# EAGLE design Testing_LAB_EMG_V1.2 (EAGLE 7.7.0)
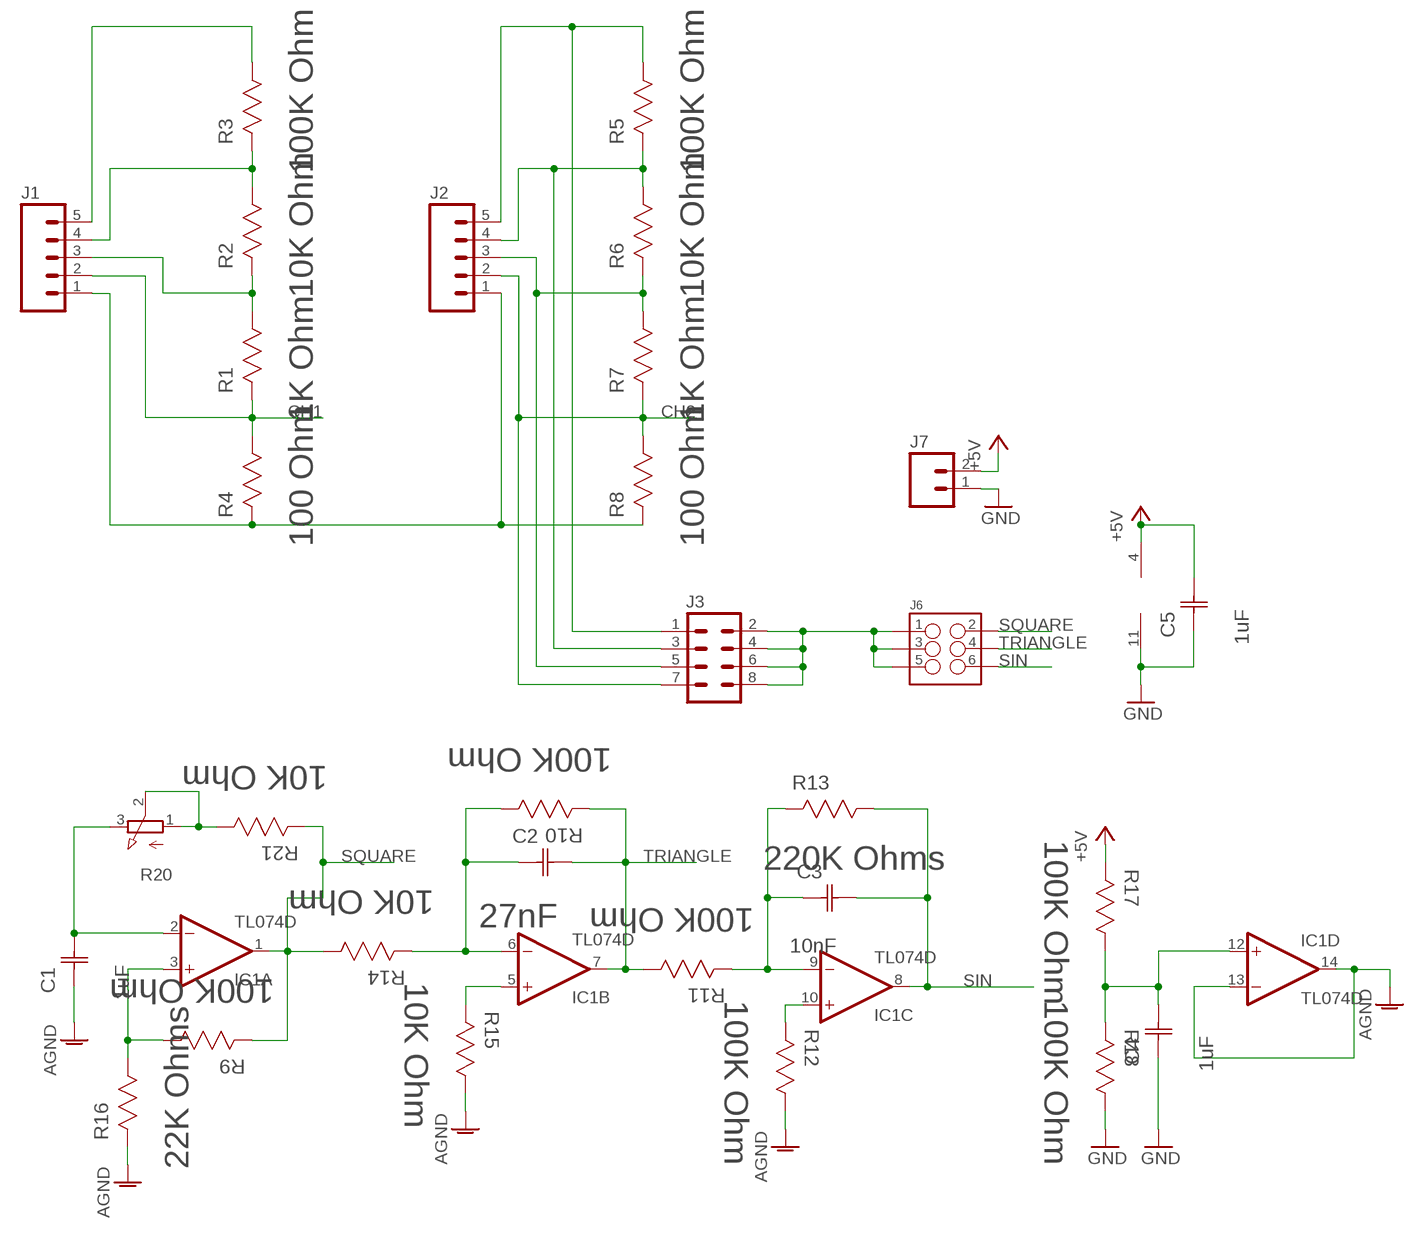
[diagram p0: schematic, sheet 1]

## Parts
C1  1uF  0603YC105KAT2A  [CAPC1608X94N]
C2  27nF  C0402C273K3RACTU  [CAPC1005X60N]
C3  10nF  06031C103KAT2A  [CAPC1608X90N]
C4  1uF  0603YC105KAT2A  [CAPC1608X94N]
C5  1uF  0603YC105KAT2A  [CAPC1608X94N]
IC1  TL074D  [SO14]
J1  M05PTH  [1X05]
J2  M05PTH  [1X05]
J3  M04X2  [2X4]
J6  M03X2NO_SILK  [2X3-NS]
J7  M02PTH  [1X02]
R1  1K Ohm  9C06031A1001FKHFT  [RESC1608X60N]
R2  10K Ohm  9C06031A1002JLHFT  [RESC1608X60N]
R3  100K Ohm  9C06031A1003FKHFT  [RESC1608X60N]
R4  100 Ohm  9C06031A1000JLHFT  [RESC1608X60N]
R5  100K Ohm  9C06031A1003FKHFT  [RESC1608X60N]
R6  10K Ohm  9C06031A1002JLHFT  [RESC1608X60N]
R7  1K Ohm  9C06031A1001FKHFT  [RESC1608X60N]
R8  100 Ohm  9C06031A1000JLHFT  [RESC1608X60N]
R9  100K Ohm  9C06031A1003FKHFT  [RESC1608X60N]
R10  100K Ohm  9C06031A1003FKHFT  [RESC1608X60N]
R11  100K Ohm  9C06031A1003FKHFT  [RESC1608X60N]
R12  100K Ohm  9C06031A1003FKHFT  [RESC1608X60N]
R13  220K Ohms  RC0603FR-07220KL  [RESC1608X60N]
R14  10K Ohm  9C06031A1002JLHFT  [RESC1608X60N]
R15  10K Ohm  9C06031A1002JLHFT  [RESC1608X60N]
R16  22K Ohms  RC0603FR-0722KL  [RESC1608X60N]
R17  100K Ohm  9C06031A1003FKHFT  [RESC1608X60N]
R18  100K Ohm  9C06031A1003FKHFT  [RESC1608X60N]
R20  3RP/1610N  [3RP/1610N]
R21  10K Ohm  9C06031A1002JLHFT  [RESC1608X60N]

## Nets
+5V: C5.2(C2) IC1.4(P:V+) J7.2 R17.2(R2)
AGND: C1.1(C1) IC1.13(D:-IN) IC1.14(D:OUT) R12.1(R1) R15.1(R1) R16.2(R2)
CH1: J1.2 R1.2(R2) R4.1(R1)
CH2: J2.2 J3.7 R7.2(R2) R8.1(R1)
GND: C4.1(C1) C5.1(C1) IC1.11(P:V-) J7.1 R18.1(R1)
N$1: J1.5 R3.1(R1)
N$2: J1.4 R2.1(R1) R3.2(R2)
N$3: J1.3 R1.1(R1) R2.2(R2)
N$5: J2.4 J3.3 R5.2(R2) R6.1(R1)
N$6: J1.1 J2.1 R4.2(R2) R8.2(R2)
N$8: J2.3 J3.5 R6.2(R2) R7.1(R1)
N$9: J2.5 J3.1 R5.1(R1)
N$10: C4.2(C2) IC1.12(D:+IN) R17.1(R1) R18.2(R2)
N$11: R20.1(A) R20.2(S) R21.1(R1)
N$12: J3.2 J3.4 J3.6 J3.8 J6.1 J6.3 J6.5
N$13: IC1.3(A:+IN) R9.1(R1) R16.1(R1)
N$14: C1.2(C2) IC1.2(A:-IN) R20.3(E)
N$16: IC1.5(B:+IN) R15.2(R2)
N$17: C2.1(C1) IC1.6(B:-IN) R10.1(R1) R14.2(R2)
N$19: IC1.10(C:+IN) R12.2(R2)
N$20: C3.1(C1) IC1.9(C:-IN) R11.2(R2) R13.2(R2)
SIN: C3.2(C2) IC1.8(C:OUT) J6.6 R13.1(R1)
SQUARE: IC1.1(A:OUT) J6.2 R9.2(R2) R14.1(R1) R21.2(R2)
TRIANGLE: C2.2(C2) IC1.7(B:OUT) J6.4 R10.2(R2) R11.1(R1)

## Library data of the parts
C1 C4 C5 = (manufact)-capacitors-AVX-element14:0603YC105KAT2A: Capacitor 0603; MPN: 0603YC105KAT2A; OC_FARNELL: 1658870; OC_NEWARK: 96M1178; SUPPLIER: AVX; TOLERANCE: ±10%; VOLTAGERATING: 16V
C2 = (manufact)-Kemet-element14:C0402C273K3RACTU: CAPACITOR, 0402; MPN: C0402C273K3RACTU; OC_FARNELL: 1865443; OC_NEWARK: 29T8944; SUPPLIER: KEMET; TOLERANCE: ±10%; VOLTAGERATING: 25V
C3 = (manufact)-capacitors-AVX-element14:06031C103KAT2A: Capacitor 0603; MPN: 06031C103KAT2A; OC_FARNELL: 1327671; OC_NEWARK: 96K4758; SUPPLIER: AVX; TOLERANCE: ±10%; VOLTAGERATING: 100V
IC1 = linear:TL074: OP AMP
J1 J2 = SparkFun-Connectors:M05: Header 5 Standard 5-pin 0.1" header. Use with straight break away headers (SKU : PRT-00116), right angle break away headers (PRT-00553), swiss pins (PRT-00743), machine pins (PRT-00117), and female headers (PRT-00115). Molex polarized connector foot print use with SKU : PRT-08230 with associated crimp pins and housings.
J3 = SparkFun-Connectors:M04X2: .1" header, two rows of four.
J6 = SparkFun-Connectors:M03X2: 2x3 .1" header. Shrouded, with keying- CONN-10681 SMT- CONN-11415 Pogo pins- HW-11044
J7 = SparkFun-Connectors:M02: Standard 2-pin 0.1" header. Use with - straight break away headers ( PRT-00116) - right angle break away headers (PRT-00553) - swiss pins (PRT-00743) - machine pins (PRT-00117) - female headers (PRT-00115) Molex polarized connector foot print use with: PRT-08233 with associated crimp pins and housings. 2.54_SCREWTERM for use with PRT-10571. 3.5mm Screw Terminal footprints for PRT-08084 5mm Screw Terminal footprints for use with PRT-08432
R1 R7 = (manufact)-resistors-YAGEO-element14:9C06031A1001FKHFT: RESISTOR, 0603; MPN: 9C06031A1001FKHFT; OC_FARNELL: -; OC_NEWARK: 64J7668; SUPPLIER: Yageo; TOLERANCE: ±1%; WATTAGE: 0.1 W
R2 R6 R14 R15 R21 = (manufact)-resistors-YAGEO-element14:9C06031A1002JLHFT: RESISTOR, 0603; MPN: 9C06031A1002JLHFT; OC_FARNELL: -; OC_NEWARK: 87K3055; SUPPLIER: Yageo; TOLERANCE: ±5%; WATTAGE: 0.1 W
R3 R5 R9-R12 R17 R18 = (manufact)-resistors-YAGEO-element14:9C06031A1003FKHFT: RESISTOR, 0603; MPN: 9C06031A1003FKHFT; OC_FARNELL: -; OC_NEWARK: 37J1396; SUPPLIER: Yageo; TOLERANCE: ±1%; WATTAGE: 0.1 W
R4 R8 = (manufact)-resistors-YAGEO-element14:9C06031A1000JLHFT: RESISTOR, 0603; MPN: 9C06031A1000JLHFT; OC_FARNELL: -; OC_NEWARK: 63J6186; SUPPLIER: Yageo; TOLERANCE: ±5%; WATTAGE: 0.1 W
R13 = (manufact)-resistors-YAGEO-element14:RC0603FR-07220KL: RESISTOR, 0603; MPN: RC0603FR-07220KL; OC_FARNELL: 1117252; OC_NEWARK: 68R0074; SUPPLIER: Yageo; TOLERANCE: ±1%; WATTAGE: 1/10 W
R16 = (manufact)-resistors-YAGEO-element14:RC0603FR-0722KL: RESISTOR, 0603; MPN: RC0603FR-0722KL; OC_FARNELL: 1117251; OC_NEWARK: 68R0072; SUPPLIER: Yageo; TOLERANCE: ±1%; WATTAGE: 1/10 W
R20 = pot:3RP/1610N: 16mm Potentiometer one level Source: http://www.alphapotentiometers.net/html/16mm_pot_2.html

## Board
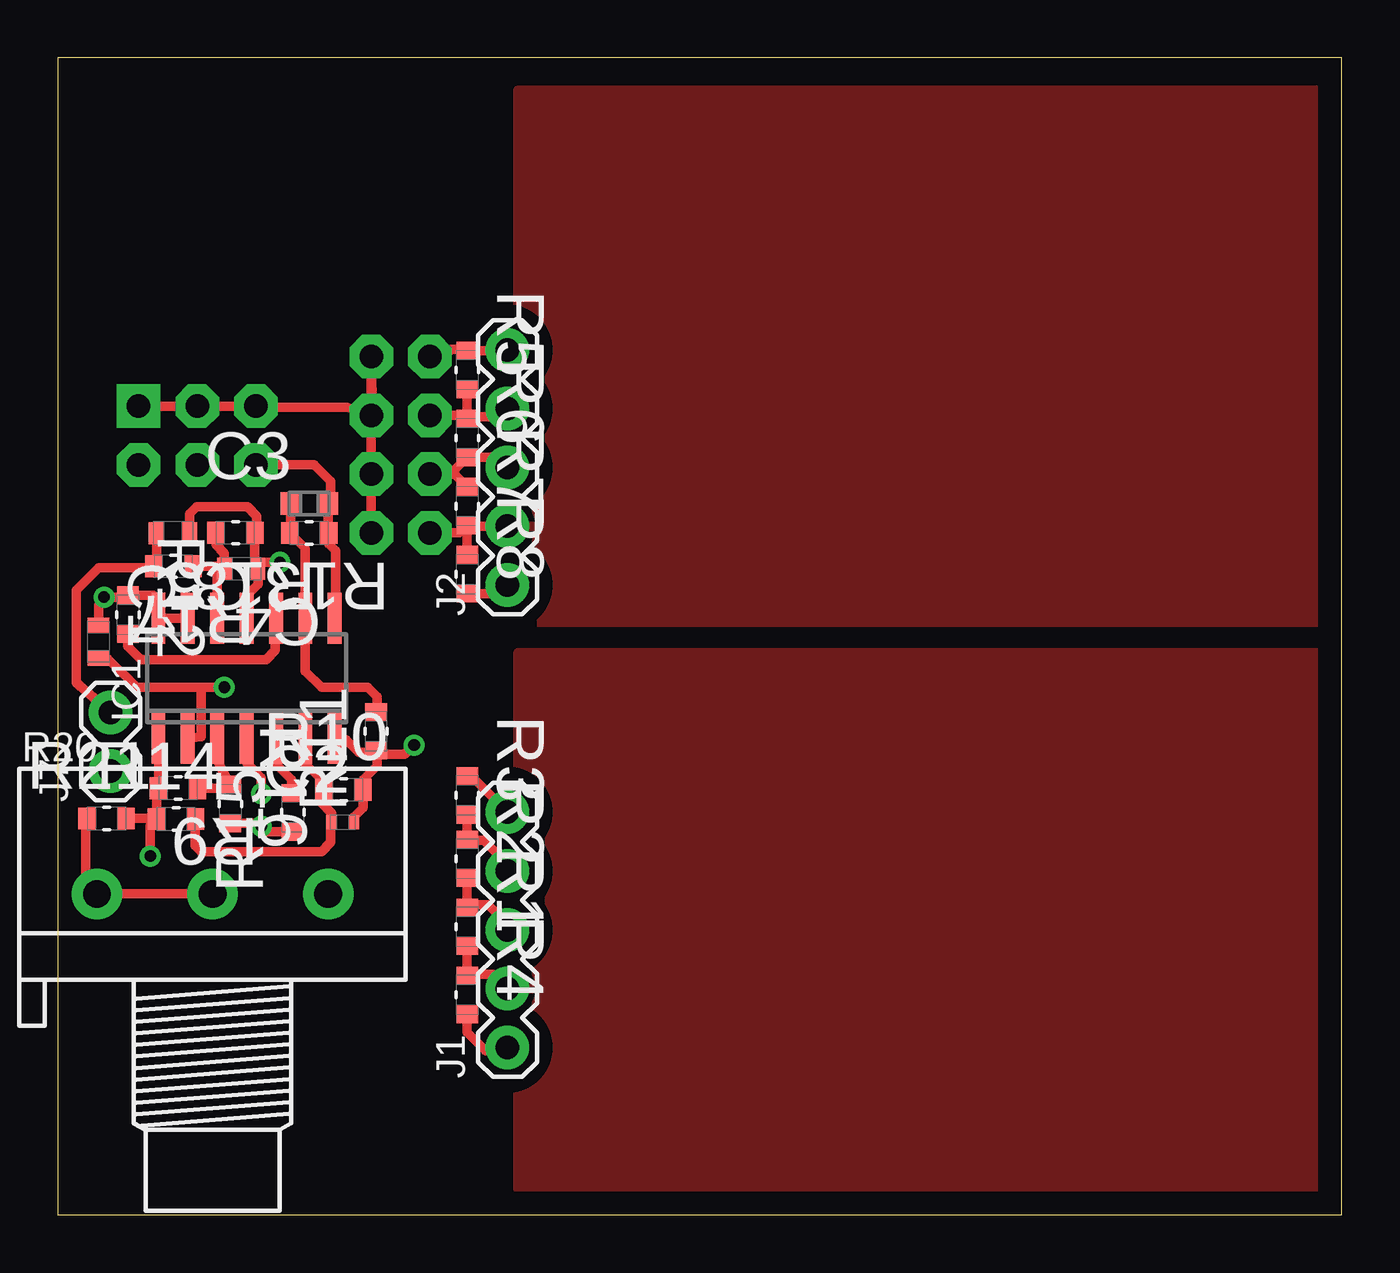
[diagram p1: board, top side]
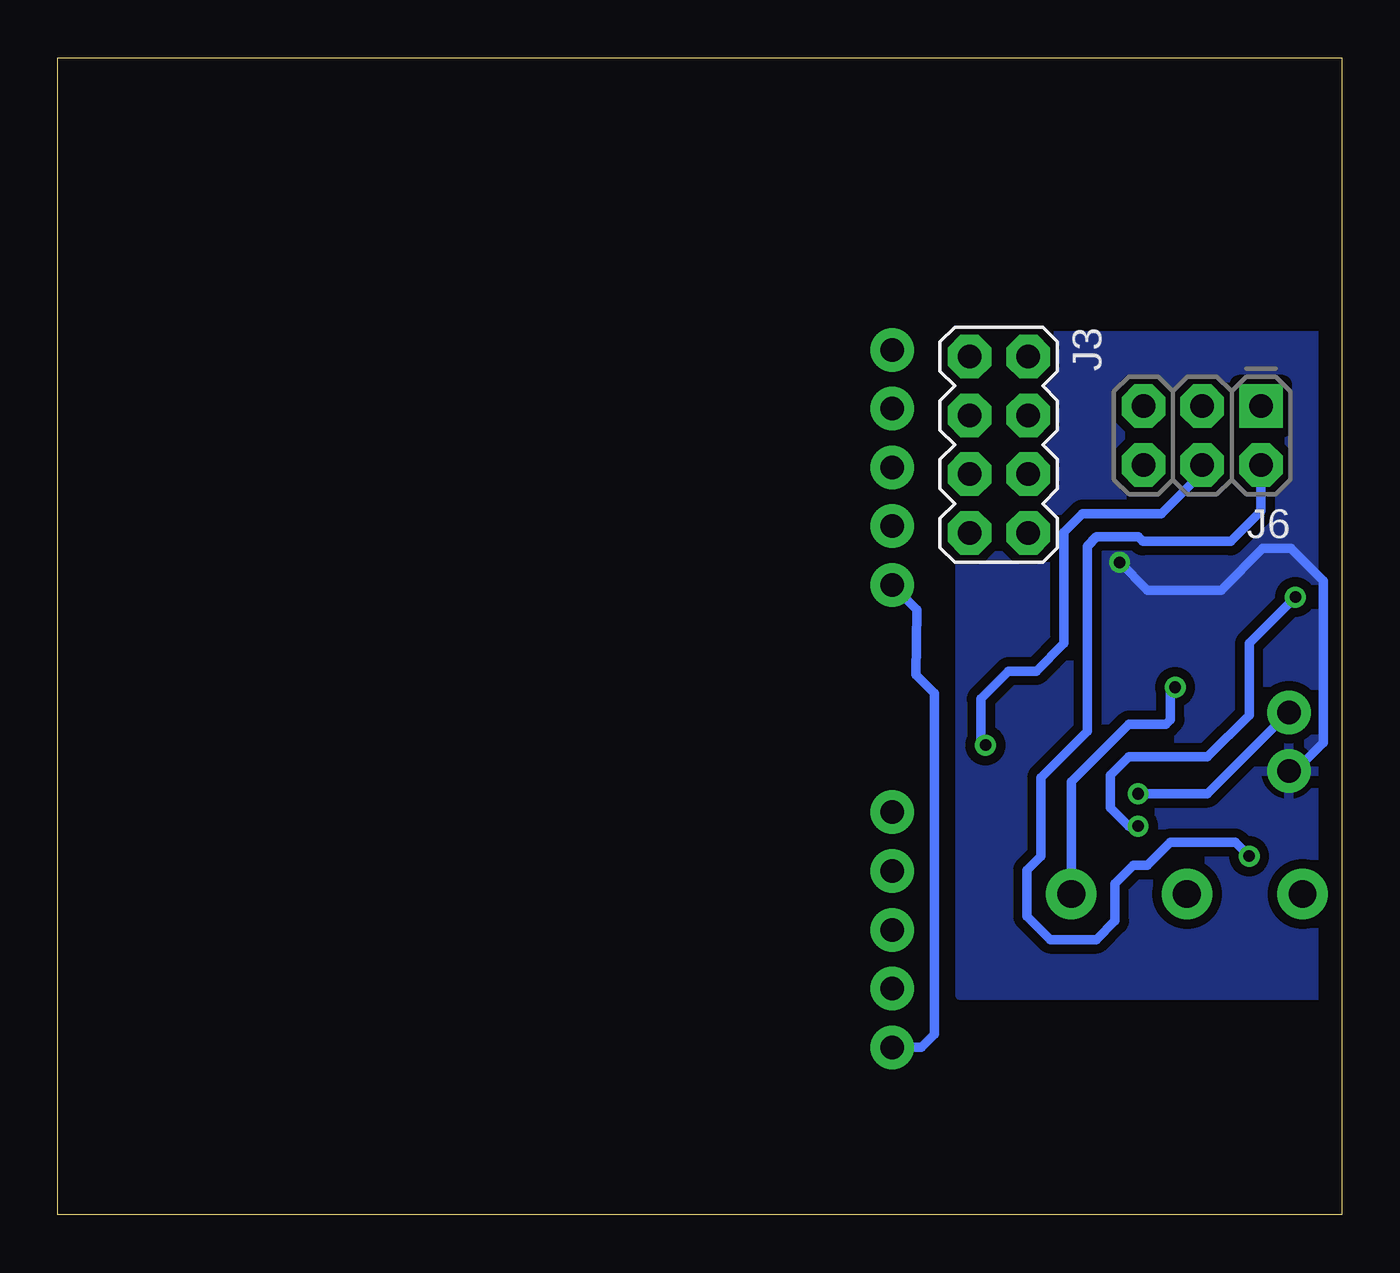
[diagram p2: board, bottom side, seen from below]

Size 55.5 x 50 mm. Coordinates in mm from the lower left corner, seen from the top.
Outline: 0,0 55.5,0 55.5,50 0,50 0,0
Copper layers (1*16): Top 0.035mm / dielectric 1.5mm / Bottom 0.035mm
Design rules "default": minimum track width 10mil, minimum drill 24mil, track to track 8mil, track to pad 8mil, pad to pad 8mil, via to via 8mil, smd to smd 8mil, copper to edge 40mil, drill to drill 8mil, minimum pad ring 10mil, minimum via ring 8mil, stop-mask expansion 4mil, vias tented up to drill 0mil, thermal gap 10mil

### Footprints (pad centres in the part's own frame; a part is rotated, then mirrored left to right if it is on the bottom)
CAPC1608X94N = smd 0.66 x 0.94: 1 -0.711,0; 2 0.711,0
CAPC1005X60N = smd 0.457 x 0.61: 1 -0.483,0; 2 0.483,0
CAPC1608X90N = smd 0.864 x 0.965: 1 -0.813,0; 2 0.813,0
SO14 = smd 0.6 x 2.2: 1 -3.81,-2.6; 2 -2.54,-2.6; 3 -1.27,-2.6; 4 0,-2.6; 5 1.27,-2.6; 6 2.54,-2.6; 7 3.81,-2.6; 8 3.81,2.6; 9 2.54,2.6; 10 1.27,2.6; 11 0,2.6; 12 -1.27,2.6; 13 -2.54,2.6; 14 -3.81,2.6
1X05 = drill 1.016 pad 1.88: 1 0,0; 2 2.54,0; 3 5.08,0; 4 7.62,0; 5 10.16,0
2X4 = drill 1.016 pad 1.88 octagon: 1 -3.81,-1.27; 2 -3.81,1.27; 3 -1.27,-1.27; 4 -1.27,1.27; 5 1.27,-1.27; 6 1.27,1.27; 7 3.81,-1.27; 8 3.81,1.27
2X3-NS = drill 1.016 pad 1.88 square: 1 -2.54,-1.27 | drill 1.016 pad 1.88 octagon: 2 -2.54,1.27; 3 0,-1.27; 4 0,1.27; 5 2.54,-1.27; 6 2.54,1.27
1X02 = drill 1.016 pad 1.88: 1 0,0; 2 2.54,0
RESC1608X60N = smd 0.762 x 0.94: 1 -0.838,0; 2 0.838,0
3RP/1610N = drill 1.2 pad 2.184: 1 -5,0; 2 0,0; 3 5,0

### Placement (x,y rotation side)
C1  1.76,24.77 270 top
C2  12.32,16.97 0 top
C3  10.87,30.74 0 top
C4  7.93,27.92 180 top
C5  4.98,29.46 180 top
IC1  8.16,23.19 0 top
J1  19.44,7.24 90 top
J2  19.44,27.22 90 top
J3  14.82,33.28 270 bottom
J6  6.03,33.68 180 bottom
J7  2.28,19.18 90 top
R1  17.7,12.45 270 top
R2  17.7,15.39 270 top
R3  17.7,18.13 270 top
R4  17.7,9.51 270 top
R5  17.7,36.51 270 top
R6  17.7,33.57 270 top
R7  17.7,30.63 270 top
R8  17.7,27.69 270 top
R9  5.2,18.44 180 top
R10  12.35,18.37 0 top
R11  13.76,20.9 90 top
R12  3.03,25.94 270 top
R13  10.87,29.47 180 top
R14  5.11,17.11 0 top
R15  10.15,17.39 90 top
R16  7.46,17.75 270 top
R17  5,28.03 180 top
R18  7.68,29.48 180 top
R20  6.69,13.87 0 top
R21  2.11,17.13 0 top

### Tracks (layer width: path | path; a pad name or v marks a point on that pad's centre or on a via)
+5V  (via drill 0.5 pad 0.25)
  Top 0.406: C5.2 4.27,28.03 R17.2 4.16,27.96 1.76,27.96 0.8,27 0.8,23 J7.2 | 8.66,18.34 v8.8,18.2 8.8,18.9 8.16,19.54 IC1.4
  Bottom 0.406: v8.8,18.2 5.8,18.2 J7.2
AGND  (via drill 0.5 pad 0.25)
  Top 0.406: IC1.13 IC1.14 4.3,26.14 4.3,26.6 4.12,26.78 R12.1 2.81,26.7 v2,26.7 1.76,26.36 C1.1 | R15.1 8.9,16.56 v8.8,16.8 8.68,16.92 R16.2
  Bottom 0.406: v8.8,16.8 9.2,16.8 10,17.6 10,19 9.2,19.8 5.8,19.8 4,21.6 4,24.7 v2,26.7
CH1
  Top 0.406: J1.2 19.42,9.78 18.8,10.4 17.75,10.4 R4.1 R1.2
  pour Top (isolate 1.016): 19.9,24.3 54.4,24.3 54.4,1.1 19.9,1.1
CH2
  Top 0.406: R7.2 R8.1 | J2.2 17.73,29.76 R7.2 | J3.7 17.38,29.47 R7.2
  pour Top (isolate 1.016): 19.9,48.6 54.4,48.6 54.4,25.6 19.9,25.6
GND  (via drill 0.5 pad 0.25)
  Top 0.406: C5.1 5.69,30.29 6,30.6 8.2,30.6 8.6,30.2 8.6,29.56 R18.1 8.52,28.04 C4.1 | v9.6,28.2 8.92,28.2 C4.1 | IC1.11 8.16,26.76 8.65,27.25 C4.1
  Bottom 0.406: J7.1 2.02,19.18 0.8,20.4 0.8,27.4 2.2,28.8 3.4,28.8 5.2,27 8.4,27 v9.6,28.2
  pour Bottom (isolate 0.406): 0.5,38 16.5,38 16.5,9.5 0.5,9.5
N$1
  Top 0.406: R3.1 17.87,18.97 J1.5
N$2
  Top 0.406: R3.2 R2.1 17.73,16.2 18.4,16.2 19.44,15.16 J1.4
N$3
  Top 0.406: R2.2 R1.1 17.81,13.4 18.6,13.4 19.44,12.56 J1.3
N$5
  Top 0.406: R5.2 R6.1 | J2.4 19.14,34.84 18.8,34.5 17.79,34.5 R6.1 | J3.3 17.56,34.55 R6.1
N$6
  Top 0.406: R8.2 19.07,26.85 J2.1 | R4.2 17.7,7.9 18.5,7.1 19.3,7.1 J1.1
  Bottom 0.406: J1.1 18.16,7.24 17.6,7.8 17.6,22.55 18.4,23.35 18.37,26.15 J2.1
N$8
  Top 0.406: J2.3 19.01,32.73 R6.2 17.16,32.19 17.16,32.01 | J3.5 17.16,32.01 | 17.16,32.01 R7.1
N$9
  Top 0.406: J2.5 19.41,37.35 R5.1 17.65,37.4 17,37.4 16.69,37.09 J3.1
N$10
  Top 0.406: R18.2 6.84,28.96 7.2,28.6 7.2,27.94 C4.2 | R17.1 7.11,28.03 C4.2 | IC1.12 6.89,27.59 C4.2
N$11
  Top 0.406: R20.1 R20.2 2.33,13.87 1.8,13.8 1.6,13.8 1.2,14.2 1.2,17.06 R21.1
N$12
  Top 0.406: J3.8 J3.6 J3.4 J3.2 13.61,34.49 12.5,34.9 8.62,34.9 J6.5 J6.3 J6.1
N$13
  Top 0.406: IC1.3 6.96,19.52 R16.1 7.3,18.44 R9.1
N$14  (via drill 0.5 pad 0.25)
  Top 0.406: 6.2,22.8 3.4,22.8 2.16,24.04 1.66,24.06 C1.2 | 6.2,22.8 6.2,20.67 IC1.2 | v7.2,22.8 6.2,22.8
  Bottom 0.406: R20.3 11.69,18.71 9.2,21.2 7.6,21.2 7.4,21.4 7.4,22.6 v7.2,22.8
N$16
  Top 0.406: IC1.5 9.43,19.47 10.1,18.8 10.1,18.29 R15.2
N$17
  Top 0.406: IC1.6 10.7,19.5 11.4,18.8 11.4,18.48 R10.1 11.4,18.26 11.4,17.8 11.84,17.36 C2.1 11.8,16.93 11.8,16.1 11.4,15.7 6.2,15.7 5.95,15.95 R14.2
N$19
  Top 0.406: R12.2 3.03,24.57 3.6,24 9,24 9.4,24.4 9.4,25.52 IC1.10
N$20
  Top 0.406: R11.2 13.8,21.78 13.8,22.4 13.4,22.8 11.4,22.8 10.7,23.5 IC1.9 10.7,28.8 R13.2 10.06,29.5 C3.1
SIN
  Top 0.406: IC1.8 12,25.82 12,28.7 11.71,28.99 R13.1 11.68,29.5 C3.2 11.8,30.86 11.8,31.7 11.09,32.41 J6.6
SQUARE  (via drill 0.5 pad 0.25)
  Top 0.406: R14.1 4.27,18.35 R9.2 4.36,20.1 IC1.1 | R21.2 4.25,17.13 R14.1 | v4,15.5 4,16.84 R14.1
  Bottom 0.406: J6.2 3.49,30.41 4.8,29.1 8.6,29.1 8.8,29.3 10.6,29.3 11,28.9 11,20.9 13,18.9 13,15.5 13.6,14.9 13.6,12.9 12.6,11.9 10.6,11.9 9.8,12.7 9.8,14.3 9,15.1 8.4,15.1 7.4,16.1 4.6,16.1 v4,15.5
TRIANGLE  (via drill 0.5 pad 0.25)
  Top 0.406: C2.2 12.8,17.2 13.2,17.6 13.2,18.36 | 13.2,18.36 R10.2 | IC1.7 12.47,20.53 13,20 13.7,20 R11.1 | 13.2,18.36 13.2,18.8 13.8,19.4 13.8,20.02 R11.1 | v15.4,20.3 15,19.9 13.92,19.9 R11.1
  Bottom 0.406: J6.4 6.03,32.07 7.8,30.3 11.2,30.3 12,29.5 12,24.7 13.2,23.5 14.4,23.5 15.6,22.3 15.6,20.5 v15.4,20.3